# EAGLE design smarty03 (EAGLE 6.5.0)
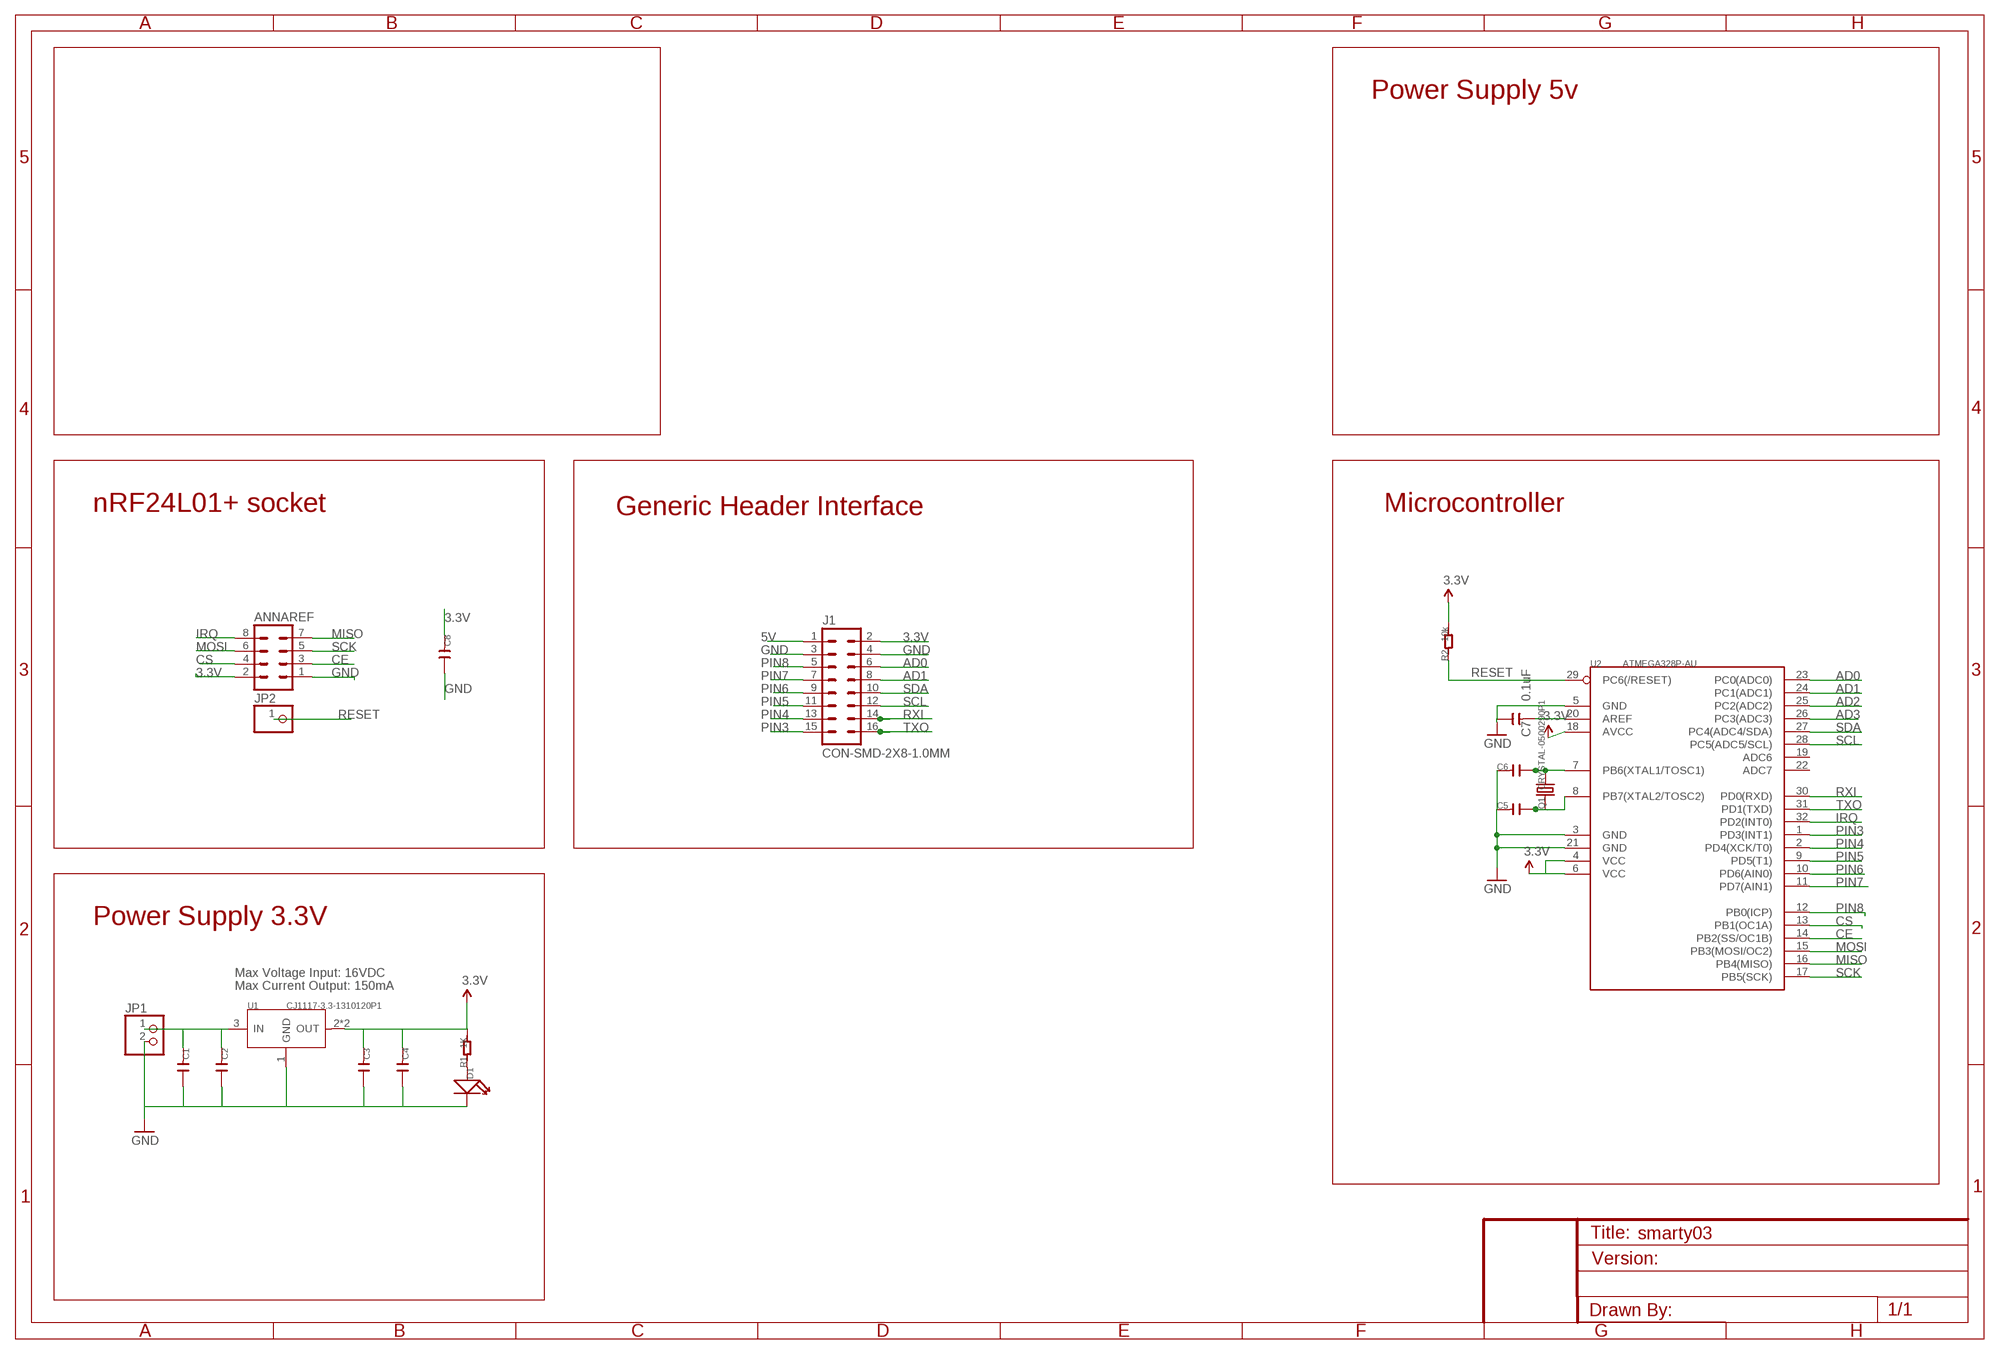
[diagram p0: schematic, sheet 1]

## Parts
ANNAREF  MA04-2  [MA04-2]
C1  C-0603  [C0603]
C2  C-0805  [C0805]
C3  C-0603  [C0603]
C4  C-0805  [C0805]
C5  C-0603  [C0603]
C6  C-0603  [C0603]
C7  0.1uF  C-0805  [C0805]
C8  C-0805  [C0805]
D1  LED  [LED0603]
J1  CON-SMD-2X8-1.0MM  [SBH100-NBPC-D08]
JP1  PINHD-1X2  [1X02]
JP2  PINHD-1X1  [1X01]
Q1  CRYSTAL-0500290P1  [2P-SMD-5.0X3.2]
R1  1K  R-0603  [R0603]
R2  10k  R-0603  [R0603]
U1  CJ1117-3.3-1310120P1  [SOT89]
U2  ATMEGA328P-AU  ATMEGA328P-AU-1030060P1  [TQFP32]

## Nets
3.3V [power]: ANNAREF.2 C3.1 C4.1 C8.1 J1.2 R1.2 R2.2 U1.2(OUT) U1.4(OUT) U2.4(VCC) U2.6(VCC) U2.18(AVCC)
5V: J1.1
AD0: J1.6 U2.23(PC0(ADC0))
AD1: J1.8 U2.24(PC1(ADC1))
AD2: U2.25(PC2(ADC2))
AD3: U2.26(PC3(ADC3))
CE: ANNAREF.3 U2.14(PB2(SS/OC1B))
CS: ANNAREF.4 U2.13(PB1(OC1A))
GND [power]: ANNAREF.1 C1.2 C2.2 C3.2 C4.2 C5.1 C6.1 C7.2 C8.2 D1.- J1.3 J1.4 JP1.2 U1.1(GND) U2.3(GND) U2.5(GND) U2.21(GND)
IRQ: ANNAREF.8 U2.32(PD2(INT0))
MISO: ANNAREF.7 U2.16(PB4(MISO))
MOSI: ANNAREF.6 U2.15(PB3(MOSI/OC2))
N$1: C7.1 U2.20(AREF)
N$2: C6.2 Q1.2 U2.7(PB6(XTAL1/TOSC1))
N$4: C5.2 Q1.1 U2.8(PB7(XTAL2/TOSC2))
N$5: D1.+ R1.1
N$6 [power]: C1.1 C2.1 JP1.1 U1.3(IN)
PIN3: J1.15 U2.1(PD3(INT1))
PIN4: J1.13 U2.2(PD4(XCK/T0))
PIN5: J1.11 U2.9(PD5(T1))
PIN6: J1.9 U2.10(PD6(AIN0))
PIN7: J1.7 U2.11(PD7(AIN1))
PIN8: J1.5 U2.12(PB0(ICP))
RESET: JP2.1 R2.1 U2.29(PC6(/RESET))
RXI: J1.14 U2.30(PD0(RXD))
SCK: ANNAREF.5 U2.17(PB5(SCK))
SCL: J1.12 U2.28(PC5(ADC5/SCL))
SDA: J1.10 U2.27(PC4(ADC4/SDA))
TXO: J1.16 U2.31(PD1(TXD))
Unconnected: U2.19(ADC6) U2.22(ADC7)

## Notes on the sheet
- Power Supply 5v
- nRF24L01+ socket | Generic Header Interface | Microcontroller
- Power Supply 3.3V
- Max Voltage Input: 16VDC
- Max Current Output: 150mA

## Library data of the parts
ANNAREF = con-lstb:MA04-2: PIN HEADER; OC_FARNELL: unknown; OC_NEWARK: unknown
C1-C8 = OPL:C*
D1 = OPL:LED*: LED
J1 = con-1.0mm:CON-SMD-2X8-1.0MM: HEADER - Vertical, Shrouded
JP1 = pinhead:PINHD-1X2: PIN HEADER
JP2 = pinhead:PINHD-1X1: PIN HEADER
Q1 = OPL:CRYSTAL*
R1 R2 = OPL:R*
U1 = OPL:CJ1117-3.3: 1A Low Dropout Linear Regulator
U2 = OPL:ATMEGA328P-AU: 8-bit AVR Microcontroller with 32K Bytes In-System Programmable Flash

## Net classes
0 default: width 0.203 mm, drill 0.203 mm, clearance 0.305 mm
1 power: width 0.254 mm, drill 0.406 mm, clearance 0.305 mm

## Board
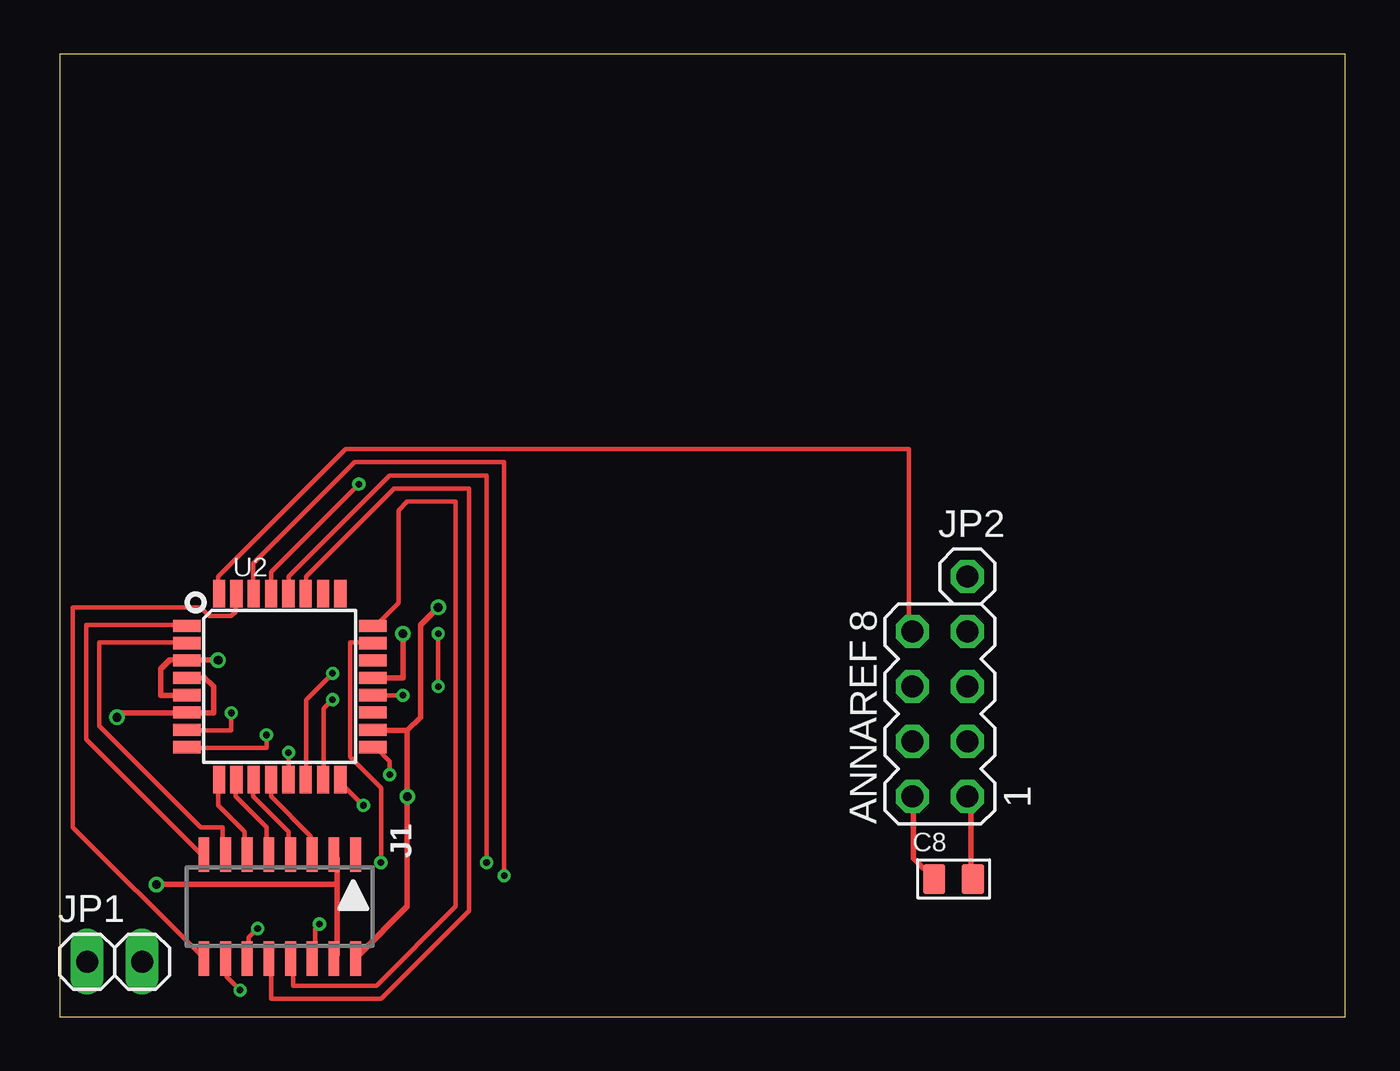
[diagram p1: board, top side]
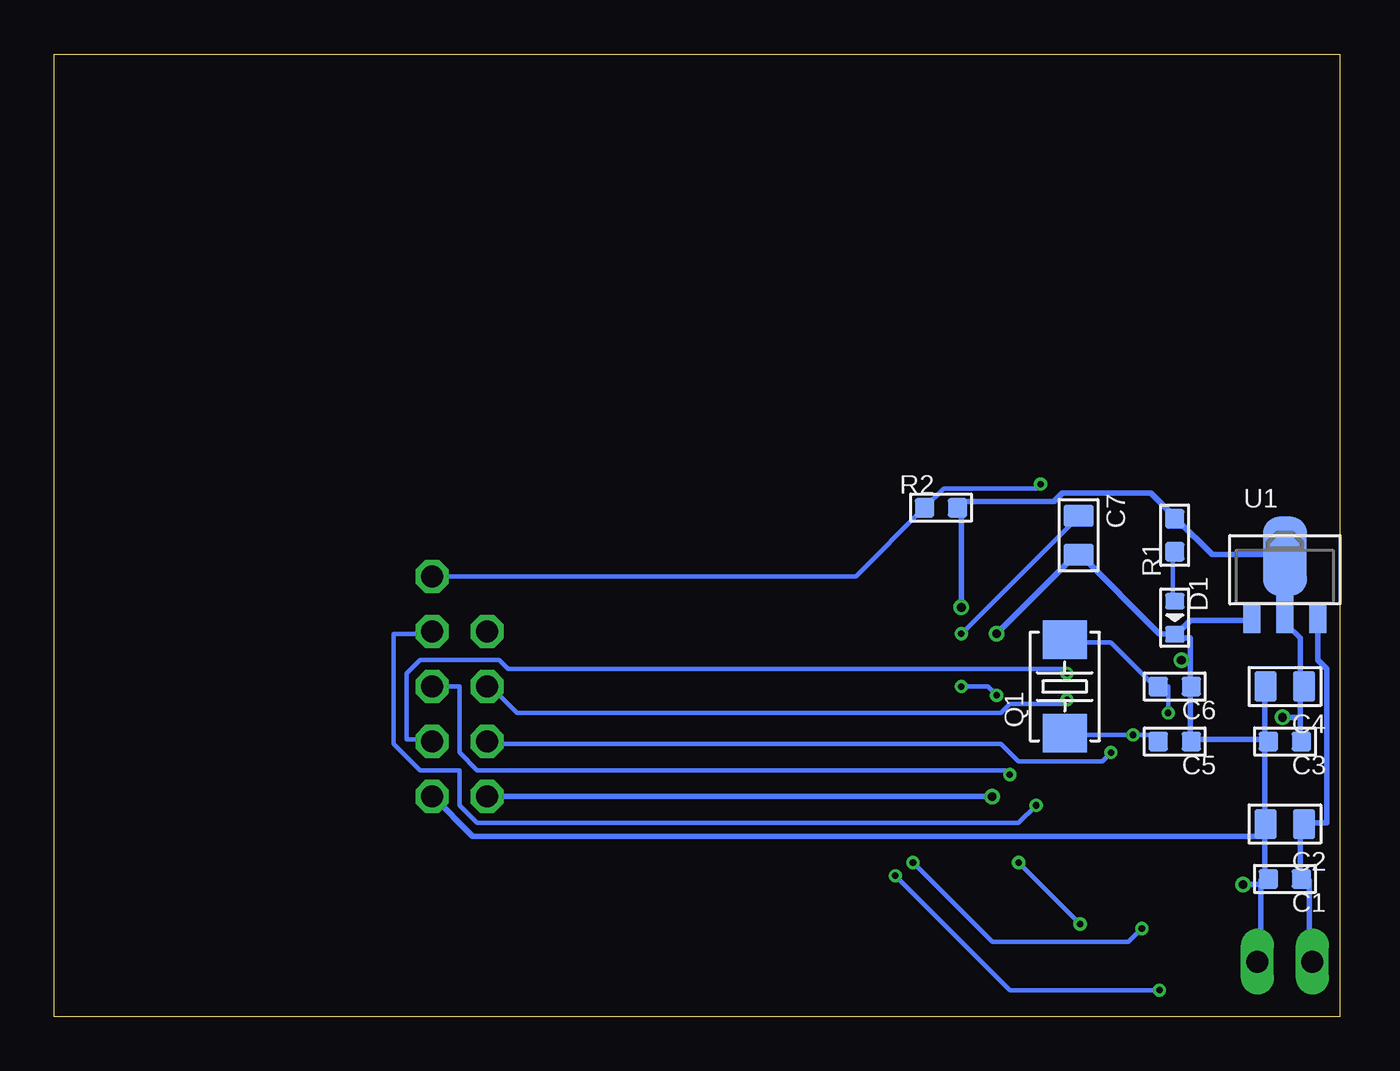
[diagram p2: board, bottom side, seen from below]

Size 59.36 x 44.44 mm. Coordinates in mm from the lower left corner, seen from the top.
Outline: 0,0 59.36,0 59.36,44.44 0,44.44 0,0
Copper layers (1*2*15*16): Top 0.035mm / dielectric 0.2mm / layer 2 0.0175mm / dielectric 1.1mm / layer 15 0.0175mm / dielectric 0.2mm / Bottom 0.035mm
Design rules "SeeedStudio_DRU_no_angle_20130527": minimum track width 6mil, minimum drill 12mil, track to track 6mil, track to pad 6mil, pad to pad 6mil, via to via 6mil, smd to smd 0mil, copper to edge 10mil, drill to drill 10mil, minimum pad ring 6mil, minimum via ring 6mil, stop-mask expansion 2mil, vias tented up to drill 25mil, thermal gap 10mil

### Footprints (pad centres in the part's own frame; a part is rotated, then mirrored left to right if it is on the bottom)
MA04-2 = drill 1.016 octagon: 1 -3.81,-1.27; 2 -3.81,1.27; 3 -1.27,-1.27; 4 -1.27,1.27; 5 1.27,-1.27; 6 1.27,1.27; 7 3.81,-1.27; 8 3.81,1.27
C0603 = smd 0.889 x 0.889: 1 -0.762,0; 2 0.762,0
C0805 = smd 1.016 x 1.397: 1 -0.889,0; 2 0.889,0
LED0603 = smd 0.762 x 0.889: + -0.762,0; - 0.762,0
SBH100-NBPC-D08 = smd 0.5 x 1.6: 1 -3.5,-2.4; 2 -3.5,2.4; 3 -2.5,-2.4; 4 -2.5,2.4; 5 -1.5,-2.4; 6 -1.5,2.4; 7 -0.5,-2.4; 8 -0.5,2.4; 9 0.5,-2.4; 10 0.5,2.4; 11 1.5,-2.4; 12 1.5,2.4; 13 2.5,-2.4; 14 2.5,2.4; 15 3.5,-2.4; 16 3.5,2.4
1X02 = drill 1.016 long: 1 -1.27,0; 2 1.27,0
1X01 = drill 1.016 octagon: 1 0,0
2P-SMD-5.0X3.2 = smd 1.778 x 2.032: 1 -2.159,0; 2 2.159,0
R0603 = smd 0.889 x 0.889: 1 -0.762,0; 2 0.762,0
SOT89 = smd 0.8 x 1.4: 1 -1.524,-1.905; 3 1.524,-1.905 | smd 0.8 x 1.9: 2 0,-1.651 | smd 2.032 x 3.65: 4 0,0.94
TQFP32 = smd 1.27 x 0.559: 1 -4.293,2.8; 2 -4.293,2; 3 -4.293,1.2; 4 -4.293,0.4; 5 -4.293,-0.4; 6 -4.293,-1.2; 7 -4.293,-2; 8 -4.293,-2.8; 17 4.293,-2.8; 18 4.293,-2; 19 4.293,-1.2; 20 4.293,-0.4; 21 4.293,0.4; 22 4.293,1.2; 23 4.293,2; 24 4.293,2.8 | smd 0.559 x 1.27: 9 -2.8,-4.293; 10 -2,-4.293; 11 -1.2,-4.293; 12 -0.4,-4.293; 13 0.4,-4.293; 14 1.2,-4.293; 15 2,-4.293; 16 2.8,-4.293; 25 2.8,4.293; 26 2,4.293; 27 1.2,4.293; 28 0.4,4.293; 29 -0.4,4.293; 30 -1.2,4.293; 31 -2,4.293; 32 -2.8,4.293

### Placement (x,y rotation side)
ANNAREF  40.64,13.97 90 top
C1  2.54,6.35 180 bottom
C2  2.54,8.89 180 bottom
C3  2.54,12.7 180 bottom
C4  2.54,15.24 180 bottom
C5  7.62,12.7 180 bottom
C6  7.62,15.24 180 bottom
C7  12.06,22.23 270 bottom
C8  41.27,6.35 0 top
D1  7.62,18.41 270 bottom
J1  10.16,5.08 180 top
JP1  2.54,2.54 0 top
JP2  41.91,20.32 0 top
Q1  12.7,15.24 90 bottom
R1  7.62,22.23 90 bottom
R2  18.41,23.5 0 bottom
U1  2.54,20.32 0 bottom
U2  10.16,15.24 0 top

### Tracks (layer width: path | path; a pad name or v marks a point on that pad's centre or on a via)
3.3V  (via drill 0.41)
  Top 0.254: U2.4 5.89,15.65 6.71,15.65 7.11,15.24 7.11,14.02 5.89,14.02 U2.6 5.69,14.02 2.64,14.02 v2.64,13.82 | C8.1 39.42,7.32 39.42,10.16 ANNAREF.2 | 16.05,13.21 14.63,13.21 U2.18 | 16.05,13.21 v16.05,10.16 16.05,5.08 13.82,2.85 J1.2 | v17.48,18.9 16.66,18.09 16.66,13.82 16.05,13.21
  Bottom 0.254: 1.83,15.24 1.83,13.82 | 1.83,13.82 1.83,12.8 C3.1 | 1.83,13.82 v2.64,13.82 | 1.83,15.24 1.83,17.48 2.44,18.09 2.44,18.49 U1.2 2.64,18.69 2.64,21.13 U1.4 2.64,21.34 5.89,21.34 7.52,22.96 R1.2 7.72,23.16 8.74,24.18 12.8,24.18 13.21,23.77 17.27,23.77 17.48,23.57 R2.2 17.48,23.37 v17.48,18.9 | 1.83,15.24 C4.1 | v16.05,10.16 ANNAREF.2
AD0  (via drill 0.3)
  Top 0.203: v14.83,7.11 14.83,10.57 13.41,11.99 13.41,17.27 14.43,17.27 U2.23 | v11.99,4.27 11.79,4.06 11.79,2.85 J1.6
  Bottom 0.203: v11.99,4.27 v14.83,7.11
AD1
  Top 0.203: U2.24 14.63,18.09 15.65,19.1 15.65,23.37 16.05,23.77 18.29,23.77 18.29,5.08 14.63,1.42 10.77,1.42 10.77,2.64 J1.8
CE  (via drill 0.3)
  Top 0.203: v12.6,15.85 11.38,14.63 11.38,10.97 U2.14
  Bottom 0.203: v12.6,15.85 12.8,16.05 38.41,16.05 38.81,16.46 42.47,16.46 43.08,15.85 43.08,12.8 42.06,12.8 ANNAREF.3
CS  (via drill 0.3)
  Top 0.203: v10.57,12.19 10.57,10.97 U2.13
  Bottom 0.203: v10.57,12.19 10.97,11.79 14.83,11.79 15.65,12.6 39.22,12.6 ANNAREF.4
GND  (via drill 0.41)
  Top 0.254: v15.85,17.68 15.85,15.65 14.63,15.65 U2.21 | U2.5 5.69,14.83 4.67,14.83 4.67,16.05 5.08,16.46 5.69,16.46 U2.3 5.89,16.46 v7.32,16.46 | C8.2 42.06,6.5 42.06,10.16 ANNAREF.1 | 12.8,6.1 12.8,7.32 J1.3 | 12.8,6.1 12.8,2.85 J1.4 | v4.47,6.1 12.8,6.1
  Bottom 0.254: v15.85,17.68 12.19,21.34 C7.2 11.99,21.34 8.33,17.68 7.72,17.68 D1.- | 6.91,15.24 6.91,12.8 C5.1 6.71,12.8 3.45,12.8 | D1.- 7.52,17.68 6.91,18.29 4.06,18.29 U1.1 | 6.91,16.46 6.91,17.48 7.52,17.48 D1.- | 6.91,16.46 6.91,15.24 | 6.91,15.24 C6.1 | 6.91,16.46 v7.32,16.46 | 3.45,8.33 3.45,8.74 C2.2 | 3.45,8.33 3.45,6.5 C1.2 | 3.45,12.8 3.45,15.24 C4.2 | C2.2 3.45,8.94 3.45,12.6 C3.2 3.45,12.8 | 3.66,6.1 3.66,6.3 3.45,6.3 C1.2 | 3.66,6.1 3.66,2.64 JP1.2 | 3.66,6.1 v4.47,6.1 | 3.66,6.1 C1.2 | 3.45,8.33 40.03,8.33 41.86,10.16 ANNAREF.1 | 3.45,8.33 C2.2
IRQ
  Top 0.203: U2.32 7.32,19.71 7.32,20.32 13.21,26.21 39.22,26.21 39.22,17.88 ANNAREF.8
MISO  (via drill 0.3)
  Top 0.203: v14.02,9.75 13.01,10.77 U2.16
  Bottom 0.203: v14.02,9.75 14.83,8.94 39.83,8.94 40.64,9.75 40.64,11.38 42.47,11.38 43.69,12.6 43.69,17.68 42.06,17.68 ANNAREF.7
MOSI  (via drill 0.3)
  Top 0.203: v12.6,14.63 12.19,14.22 12.19,10.97 U2.15
  Bottom 0.203: v12.6,14.63 12.8,14.43 15.24,14.43 15.65,14.02 38,14.02 39.22,15.24 ANNAREF.6
N$1  (via drill 0.3)
  Top 0.203: v15.85,14.83 14.63,14.83 U2.20 | v17.48,17.68 v17.48,15.24
  Bottom 0.203: v15.85,14.83 16.26,15.24 v17.48,15.24 | v17.48,17.68 12.19,22.96 C7.1
N$2  (via drill 0.3)
  Top 0.203: v7.92,14.02 7.92,13.21 5.89,13.21 U2.7
  Bottom 0.203: Q1.2 12.6,17.27 10.57,17.27 8.53,15.24 C6.2 7.92,15.24 v7.92,14.02
N$4  (via drill 0.3)
  Top 0.203: v9.55,13.01 9.55,12.39 5.89,12.39 U2.8
  Bottom 0.203: C5.2 8.53,12.8 8.74,13.01 v9.55,13.01 12.6,13.01 Q1.1
N$5
  Bottom 0.203: D1.+ 7.72,19.3 7.72,21.34 R1.1
N$6
  Bottom 0.254: U1.3 1.02,16.46 0.61,16.05 0.61,8.94 1.63,8.94 C2.1 1.83,8.74 1.83,6.5 C1.1 1.63,6.3 1.42,6.3 1.42,2.64 JP1.1
PIN3
  Top 0.203: U2.1 5.69,18.09 1.22,18.09 1.22,12.8 6.5,7.52 J1.15
PIN4
  Top 0.203: U2.2 5.69,17.27 1.83,17.27 1.83,13.41 6.5,8.74 7.52,8.74 7.52,7.52 J1.13
PIN5
  Top 0.203: U2.9 7.32,10.77 7.32,9.75 8.53,8.53 8.53,7.52 J1.11
PIN6
  Top 0.203: U2.10 8.13,10.77 8.13,10.16 9.55,8.74 9.55,7.52 J1.9
PIN7
  Top 0.203: U2.11 8.94,10.77 8.94,10.16 10.57,8.53 10.57,7.52 J1.7
PIN8
  Top 0.203: U2.12 9.75,10.77 9.75,10.16 11.58,8.33 11.58,7.52 J1.5
RESET  (via drill 0.3)
  Top 0.203: v13.82,24.59 9.75,20.52 9.75,19.71 U2.29
  Bottom 0.203: JP2.1 22.35,20.32 R2.1 18.29,24.38 14.02,24.38 v13.82,24.59
RXI  (via drill 0.3)
  Top 0.203: v20.52,6.5 20.52,25.6 13.61,25.6 8.94,20.93 8.94,19.71 U2.30 | v8.33,1.22 7.72,1.83 7.72,2.64 J1.14
  Bottom 0.203: v20.52,6.5 15.24,1.22 v8.33,1.22
SCK  (via drill 0.3)
  Top 0.203: v15.24,11.18 15.24,11.79 14.63,12.39 U2.17
  Bottom 0.203: v15.24,11.18 15.44,11.38 39.83,11.38 40.64,12.19 40.64,15.24 ANNAREF.5
SCL  (via drill 0.3)
  Top 0.203: v19.71,7.11 19.71,24.99 15.24,24.99 10.57,20.32 10.57,19.71 U2.28 | v9.14,4.06 8.74,3.66 8.74,2.85 J1.12
  Bottom 0.203: v19.71,7.11 16.05,3.45 9.75,3.45 v9.14,4.06
SDA
  Top 0.203: U2.27 11.38,19.71 11.38,20.32 15.44,24.38 18.9,24.38 18.9,4.88 14.83,0.81 9.75,0.81 9.75,2.64 J1.10
TXO
  Top 0.203: U2.31 8.13,19.51 8.13,18.69 7.92,18.49 6.91,18.49 6.5,18.9 0.61,18.9 0.61,8.74 6.5,2.85 J1.16